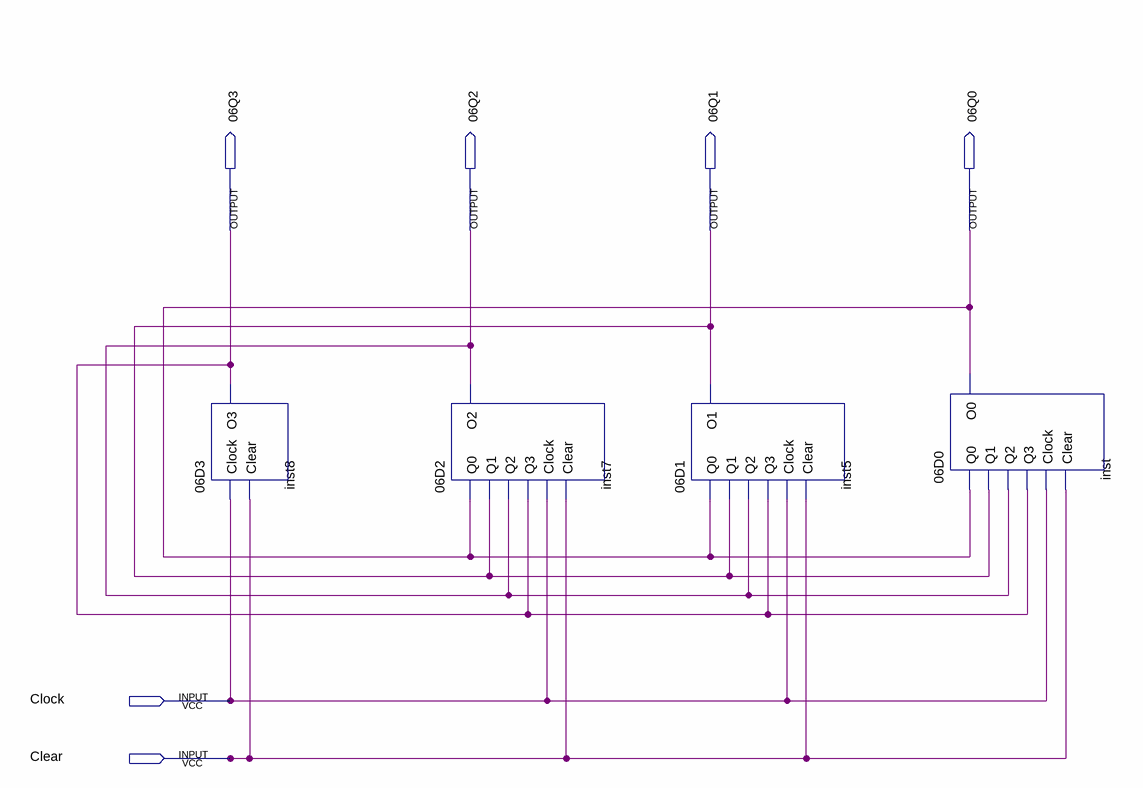
[diagram p0: schematic sheet]
// Quartus schematic Contador06.bdf as structural Verilog: 4 symbols, 6 pins
module Contador06 (
  input  Clock,
  input  Clear,
  output \06Q3 ,
  output \06Q2 ,
  output \06Q1 ,
  output \06Q0 
);

  \06D3  inst8 (.Clock(Clock), .Clear(Clear), .O3(\06Q3 ));
  \06D2  inst7 (.Q0(\06Q0 ), .Q1(\06Q1 ), .Q2(\06Q2 ), .Q3(\06Q3 ), .Clock(Clock), .Clear(Clear), .O2(\06Q2 ));
  \06D1  inst5 (.Q0(\06Q0 ), .Q1(\06Q1 ), .Q2(\06Q2 ), .Q3(\06Q3 ), .Clock(Clock), .Clear(Clear), .O1(\06Q1 ));
  \06D0  inst (.Q0(\06Q0 ), .Q1(\06Q1 ), .Q2(\06Q2 ), .Q3(\06Q3 ), .Clock(Clock), .Clear(Clear), .O0(\06Q0 ));
endmodule
